# Altium schematic sheet UART.SchDoc: Convertisseur USB/UART
size A4; CheckedBy: Tissot Léo / Lanfroid-Nazac Guillaume; DrawnBy: Zorzetto Damien; Revision: V1.1; SheetNumber: 7; SheetTotal: 7
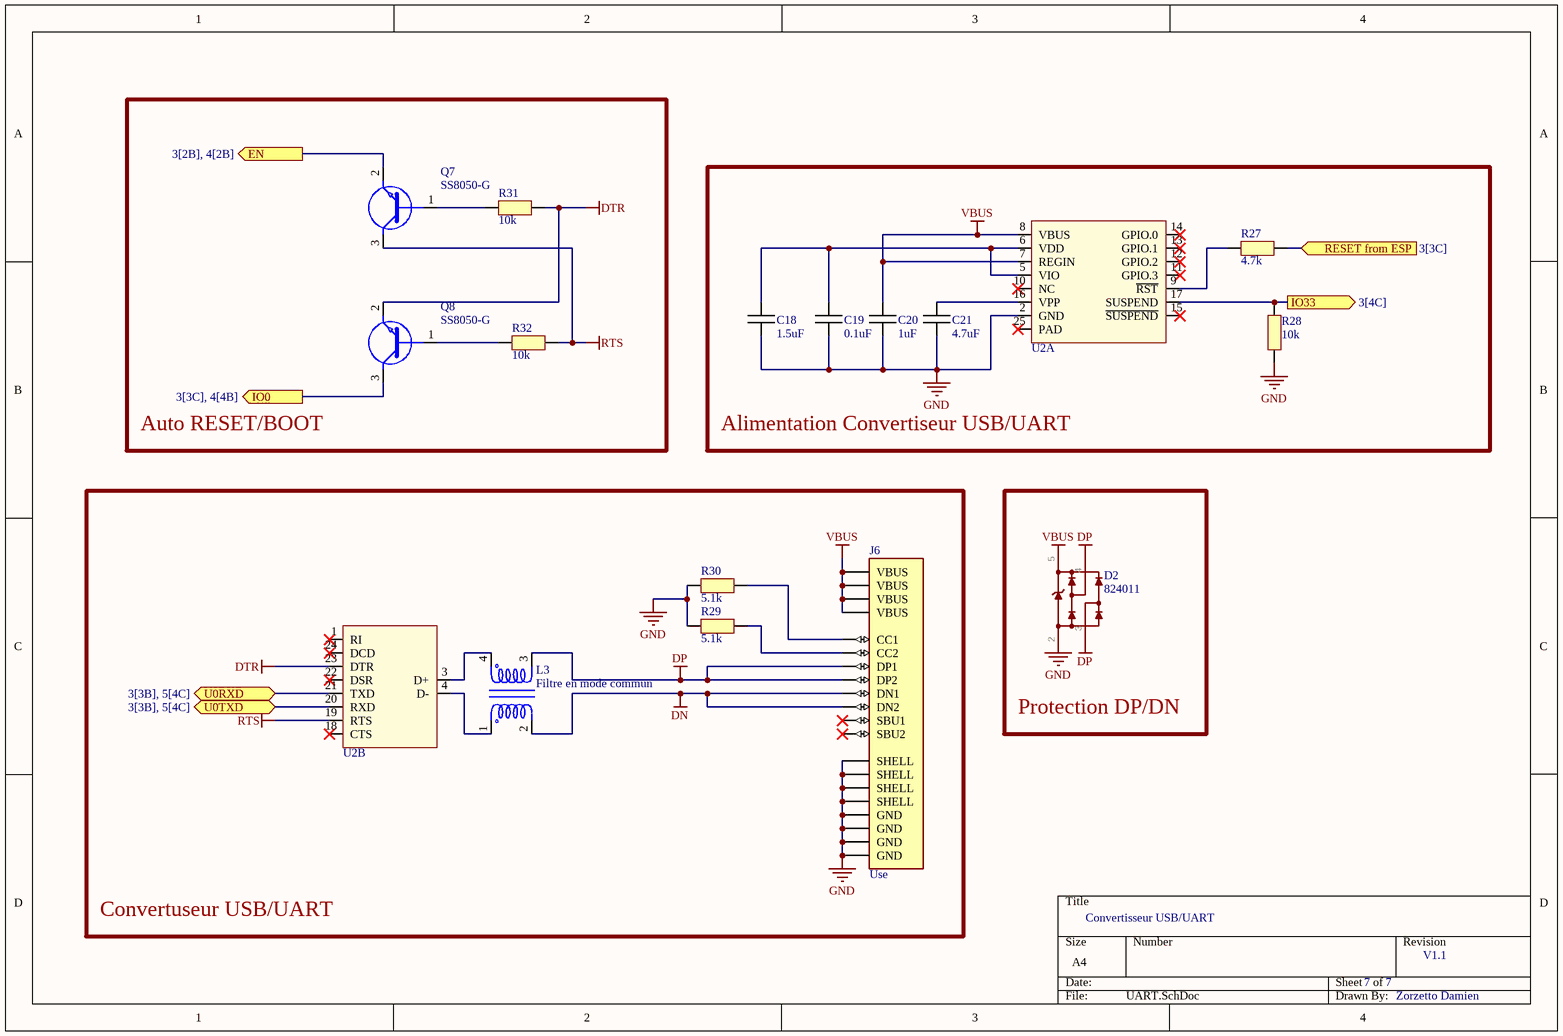
[diagram p0: UART.SchDoc]

## Parts
C18  1.5uF  [CAPC1005X06N]
C19  0.1uF  [CAPC1005X06N]
C20  1uF  [CAPC1005X06N]
C21  4.7uF  [CAPC1005X06N]
D2  824011  [824011]
J6  Use  [USB4085-GF-A]
L3  Filtre en mode commun  [744232090]
Q7  SS8050-G  [SS8050-G]
Q8  SS8050-G  [SS8050-G]
R27  4.7k  [RESC1005X06N]
R28  10k  [RESC1005X06N]
R29  5.1k  [RESC1005X06N]
R30  5.1k  [RESC1005X06N]
R31  10k  [RESC1005X06N]
R32  10k  [RESC1005X06N]
U2  CP2104-F03-GM  [PQFN50P400X400X80_HS-25N]  (value not drawn)  (parts A,B of 2)

## Blocks framed on the sheet
Auto RESET/BOOT: Q7 Q8 R31 R32
Alimentation Convertiseur USB/UART: C18-C21 R27 R28 U2
Convertuseur USB/UART: J6 L3 R29 R30 U2
Protection DP/DN: D2

## Ports
EN (out, see 3[2B], 4[2B]), IO0 (out, see 3[3C], 4[4B]), IO33 (out, see 3[4C]), RESET from ESP (in, see 3[3C]), U0RXD (bidir, see 3[3B], 5[4C]), U0TXD (bidir, see 3[3B], 5[4C])

## Nets
DN: J6.A7(DN1) J6.B7(DN2) L3.2
DP: D2.3 D2.4 J6.A6(DP1) J6.B6(DP2) L3.3
DTR: Q8.2(E) R31.1 U2.23(DTR)
GND: C18.2 C19.2 C20.2 C21.2 D2.2(GND) J6.A1(GND) J6.A12(GND) J6.B1(GND) J6.B12(GND) J6.S1(SHELL) J6.S2(SHELL) J6.S3(SHELL) J6.S4(SHELL) R28.2 R29.2 R30.2 U2.2(GND)
RTS: Q7.3(C) R32.1 U2.19(RTS)
VBUS: C20.1 D2.5(VDD) J6.A4(VBUS) J6.A9(VBUS) J6.B4(VBUS) J6.B9(VBUS) U2.7(REGIN) U2.8(VBUS)
EN: Q7.2(E) ; port EN
IO0: Q8.3(C) ; port IO0
IO33: R28.1 U2.17(SUSPEND) ; port IO33
RESET from ESP: R27.1 ; port RESET from ESP
U0RXD: U2.21(TXD) ; port U0RXD
U0TXD: U2.20(RXD) ; port U0TXD
NetC18_1: C18.1 C19.1 U2.5(VIO) U2.6(VDD)
NetC21_1: C21.1 U2.16(VPP)
NetJ6_A5: J6.A5(CC1) R30.1
NetJ6_B5: J6.B5(CC2) R29.1
NetL3_1: L3.1 U2.4(D-)
NetL3_4: L3.4 U2.3(D+)
NetQ7_1: Q7.1(B) R31.2
NetQ8_1: Q8.1(B) R32.2
NetR27_2: R27.2 U2.9(~{RST})

Not connected (* = marked no-connect by the designer): J6 A8(SBU1)* B8(SBU2)*; U2 1(RI)* 10(NC)* 11(GPIO.3)* 12(GPIO.2)* 13(GPIO.1)* 14(GPIO.0)* 15(~{SUSPEND})* 18(CTS)* 22(DSR)* 24(DCD)* 25(PAD)*

## Notes on the sheet
- 7

## Library data of the parts
C18-C21 = Capacitor
D2 = 824011: TVS Diode Array WE-TVS, High Speed Series  - Low capazity - No leakage current - Low clamping voltage - high ESD voltage protection  -- USB 1.0 - 2.0
J6 = USB4085-GF-A: Connecteurs USB USB Type C, 2.0, Rec, TH , G/F, RA , Top Mnt, T & R
L3 = 744232090: Bobines / filtres en mode commun WE-CNSW 1206 370mA 90Ohm 100MHz AECQ200
Q7 Q8 = SS8050-G: Bipolar Transistors - BJT NPN TRANSISTOR 1.5A 40V
R27-R32 = Resistor
U2 = USBBridge: USB Bridge, USB to UART USB 2.0 UART Interface 24-QFN (4x4); Manufacturer 1: Silicon Labs; Supplier 1: Arrow Electronics; Supplier Part Number 1: CP2104-F03-GM; Manufacturer Part Number 1: CP2104-F03-GM